# Altium schematic sheet ___Main.SchDoc
size A3; Address1: 00-<Schema Name>; ModifiedBy: -; RevisionDate: -; Size: A3
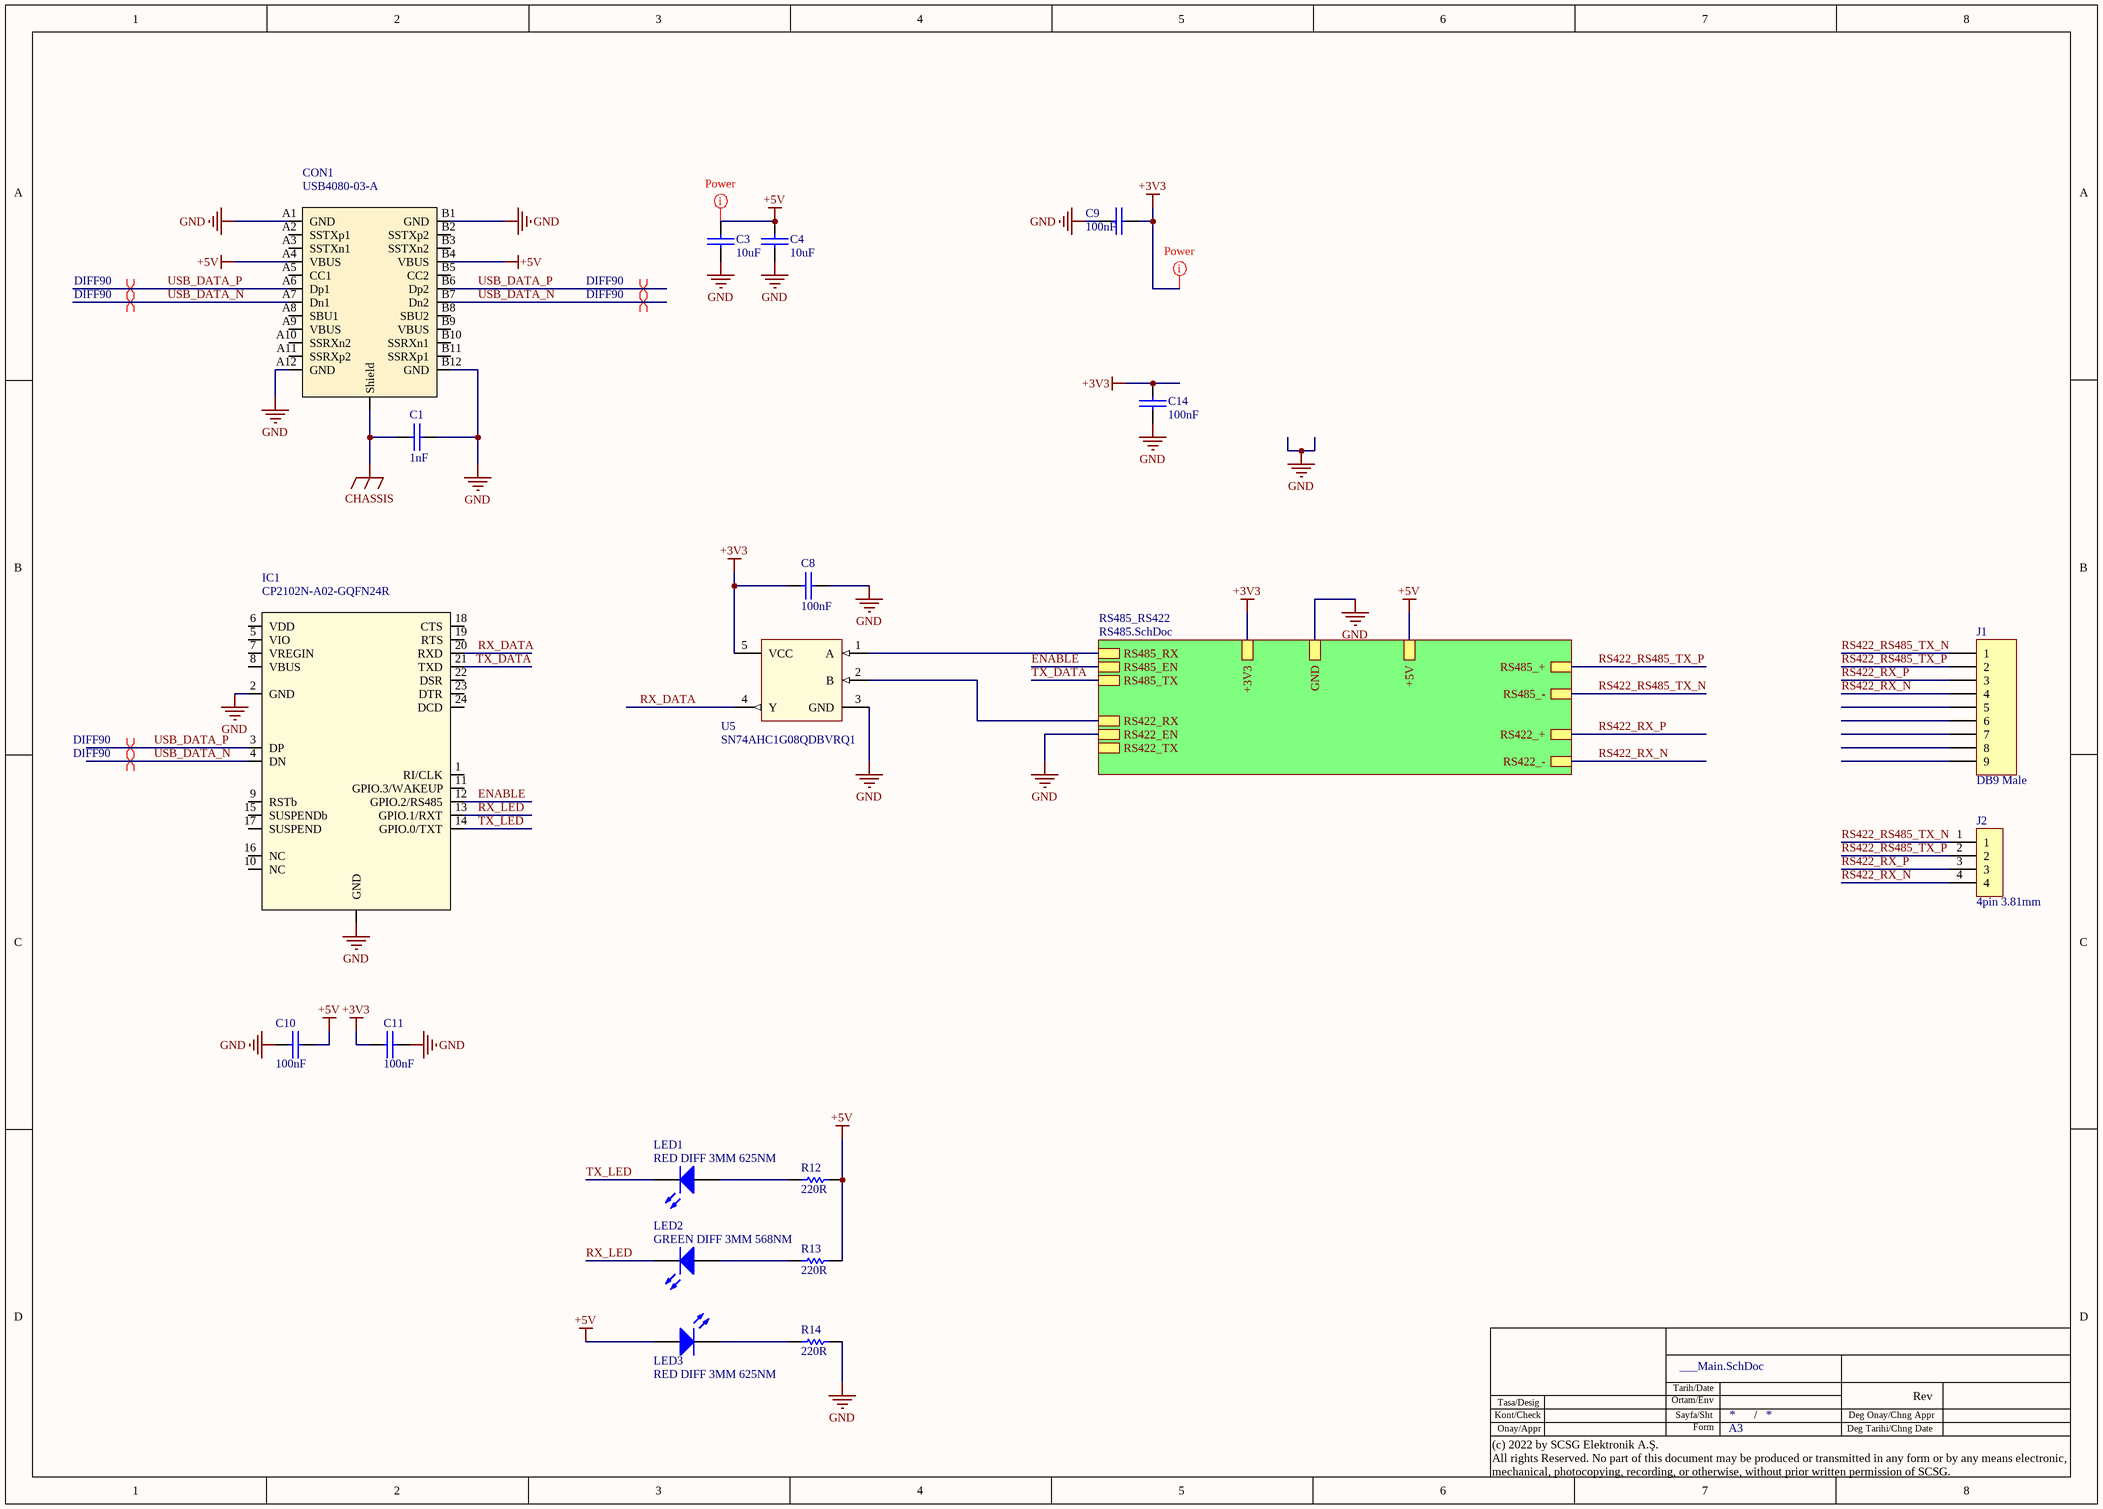
[diagram p0: ___Main.SchDoc]

## Parts
C1  value 1nF  [C1206-N - H 1.75×L 3.4×W 1.8]  (hidden comment: CAPL10012820E)
C3  value 10uF  [C0603-N]  (hidden comment: CAP110050340F)
C4  value 10uF  [C0603-N]  (hidden comment: CAP110050340F)
C8  value 100nF  [C0402-N]  (hidden comment: CAP110030425E)
C9  value 100nF  [C0402-N]  (hidden comment: CAP110030425E)
C10  value 100nF  [C0402-N]  (hidden comment: CAP110030425E)
C11  value 100nF  [C0402-N]  (hidden comment: CAP110030425E)
C14  value 100nF  [C0402-N]  (hidden comment: CAP110030425E)
CON1  USB4080-03-A  [GCT_USB4080-03-A_REVA1]
IC1  CP2102N-A02-GQFN24R  [QFN24]
J1  value DB9 Male  [CON110090001]  (hidden comment: CON110090001)
J2  value 4pin 3.81mm  [PV04-3,81]  (hidden comment: CON1500412AE)
LED1  value RED DIFF 3MM 625NM  [RADIAL 3.2X5.4]  (hidden comment: LED0002WP710)
LED2  value GREEN DIFF 3MM 568NM  [RADIAL 3.2X5.4]  (hidden comment: LED0202WP710)
LED3  value RED DIFF 3MM 625NM  [RADIAL 3.2X5.4]  (hidden comment: LED0002WP710)
R12  value 220R  [0402-N]  (hidden comment: RESE24002201)
R13  value 220R  [0402-N]  (hidden comment: RESE24002201)
R14  value 220R  [0402-N]  (hidden comment: RESE24002201)
U5  value SN74AHC1G08QDBVRQ1  [SOT23-5]  (hidden comment: IC74AHC1G081)

## Sub-sheets
RS485_RS422 = RS485.SchDoc: RS485_RX, RS485_EN, RS485_TX, RS422_RX, RS422_EN, RS422_TX, RS485_+, RS485_-, RS422_-, RS422_+, +3V3, GND, +5V

## Nets
+3V3: C8.2 C9.1 C11.1 C14.2 U5.5(VCC) ; sheet RS485_RS422/+3V3
+5V: C3.2 C4.2 C10.1 CON1.A4(VBUS) CON1.B4(VBUS) LED3.1(A) R12.2 R13.2 ; sheet RS485_RS422/+5V
CHASSIS: C1.2 CON1.G(Shield)
GND: C1.1 C3.1 C4.1 C8.1 C9.2 C10.2 C11.2 C14.1 CON1.A1(GND) CON1.A12(GND) CON1.B1(GND) CON1.B12(GND) IC1.2(GND) IC1.25(GND) R14.2 U5.3(GND) ; sheet RS485_RS422/RS422_EN, sheet RS485_RS422/GND
ENABLE: IC1.12(GPIO.2/RS485) ; sheet RS485_RS422/RS485_EN
RS422_RS485_TX_N: J1.1 J2.1 ; sheet RS485_RS422/RS485_-
RS422_RS485_TX_P: J1.2 J2.2 ; sheet RS485_RS422/RS485_+
RS422_RX_N: J1.4 J2.4 ; sheet RS485_RS422/RS422_-
RS422_RX_P: J1.3 J2.3 ; sheet RS485_RS422/RS422_+
RX_DATA: IC1.20(RXD) U5.4(Y)
RX_LED: IC1.13(GPIO.1/RXT) LED2.2(K)
TX_DATA: IC1.21(TXD) ; sheet RS485_RS422/RS485_TX
TX_LED: IC1.14(GPIO.0/TXT) LED1.2(K)
USB_DATA_N: CON1.A7(Dn1) CON1.B7(Dn2) IC1.4(DN)
USB_DATA_P: CON1.A6(Dp1) CON1.B6(Dp2) IC1.3(DP)
NetLED1_1: LED1.1(A) R12.1
NetLED2_1: LED2.1(A) R13.1
NetLED3_2: LED3.2(K) R14.1
NetU5_1: U5.1(A) ; sheet RS485_RS422/RS485_RX
NetU5_2: U5.2(B) ; sheet RS485_RS422/RS422_RX

Not connected (* = marked no-connect by the designer): CON1 A2(SSTXp1) A3(SSTXn1) A5(CC1) A8(SBU1) A9(VBUS) A10(SSRXn2) A11(SSRXp2) B2(SSTXp2) B3(SSTXn2) B5(CC2) B8(SBU2) B9(VBUS) B10(SSRXn1) B11(SSRXp1); IC1 1(RI/CLK) 5(VIO) 6(VDD) 7(VREGIN) 8(VBUS) 9(RSTb) 10(NC) 11(GPIO.3/WAKEUP) 15(SUSPENDb) 16(NC) 17(SUSPEND) 18(CTS) 19(RTS) 22(DSR) 23(DTR) 24(DCD); J1 5 6 7 8 9

## Layout directives
net class PowerGeneral: +3V3, +5V
differential pair; net class DIFF90: USB_DATA_N, USB_DATA_P

## Notes on the sheet
- Tarih/Date
- Kont/Check
- Tasa/Desig
- Onay/Appr
- Ortam/Env
- Sayfa/Sht
- Form
- A3
- /
- Deg Tarihi/Chng Date
- Deg Onay/Chng Appr
- Rev
- (c) 2022 by SCSG Elektronik A.Ş.
  All rights Reserved. No part of this document may be produced or transmitted in any form or by any means electronic, mechanical, photocopying, recording, or otherwise, without prior written permission of SCSG.

## Library data of the parts
C1 = CAPL10012820E: 1nF, 1206, X7R, 2kV, % 10, AEC-Q200; Manufacturer: Kemet; Requested By: Mehmet Ali İpin; Order Number: C1206C102KGRACAUTO; DS: 14477; Tolerance: +10% -10%; Value1: C3100; Talep ID: 3983; Capacitance: 1000pF; Voltage - Rated: 2000V (2kV); Tanımlanma Tarihi: 03.03.2016; Revizyon Tarihi: 03.03.2016; Price: 0,0517; Operating Temperature: -55C +125C; Height: 1.75mm; helpURL: \\pavofilesrv\DataSheets\DS14400\DS14477.PDF; Package / Case: C1206-N - H 1.75×L 3.4×W 1.8, C1206-S - H 1.75×L 3.4×W 1.8; Digikey Code: 399-12976-2-ND; Mounting Type: Surface Mount, MLCC; Moisture Sensitivity Level (MSL): 1; Supplier 1: Digi-Key; Supplier Part Number 1: 399-12976-2-ND; RoHS: RoHS Compliant; Category: Capacitors; Packaging: Tape & Reel (TR); Temperature Coefficient: X7R; Applications: Automotive; Ratings: AEC-Q200; Size / Dimension: 0.126" L x 0.063" W (3.20mm x 1.60mm); Features: High Voltage; ComponentLink1URL: http://www.kemet.com/docfinder?Partnumber=C1206C102KGRACAUTO; ComponentLink1Description: http://www.kemet.com/docfinder?Partnumber=C1206C102KGRACAUTO
C3 C4 = CAP110050340F: 10uF, 0603,  X5R, 10V, % 20; Manufacturer: Samsung; Requested By: Mehmet Ali İPİN; Order Number: CL10A106MP8NNNC; DS: 13591; Capacitance (pF): 10000000; Tolerance: 20; Value1: C7100; Talep ID: 2378; Tanımlanma Tarihi: 23.10.2013; Revizyon Tarihi: 23.10.2013; Price: 0,0765; Operating Temperature: -55°C ~ 85°C; Height: 0.9mm; helpURL: \\pavofilesrv\DataSheets\DS13500\DS13591.pdf; Voltage - Rated: 10V; Package / Case: 0603; Digikey Code: 1276-1871-2-ND; Mounting Type: Surface Mount; Moisture Sensitivity Level (MSL): 1
C8-C11 C14 = CAP110030425E: 100nF, 0402, X7R, 16V, % 10; Manufacturer: Samsung; Manufacturer1: TDK Corporation; Order Number: CL05B104KO5NNNC; DS: 13510; Tolerance: % 10; Order Number1: C1005X7R1C104K; Order Number2: C0402C104K4RACTU; Value1: C5100; Price: 0,00100; Height: 0.55mm; Digikey Code: 1276-1001-2-ND; helpURL: \\pavofilesrv\DataSheets\DS13500\DS13510.pdf; Manufacturer2: Kemet; Mounting Type: Surface Mount; Moisture Sensitivity Level (MSL): 1; Digikey Code2: 399-3521-2-ND
CON1 = USB4080-03-A: USB Type C Rec, 3 Horizontal, SMT, Top mnt, 7.9mm body; Manufacturer: Global Connector Technology; Gender: Receptacle; Purpose Of Usage: BASIC; Supplier 1: Future Electronics; Manufacturer Part Number: USB4080-03-A; RoHS: Yes; Category: CONNECTORS; Supplier Part Number 1: 5146382; Orientation: Right Angle; Sub-Category: USB Type-C; Mount: SMD; Local Supplier: FUTURE; Price 10K: 0.463; Stock ID: ??
IC1 = CP2102N-A02-GQFN24R: IC Usb to Uart Bridge QFN24 / Usb Bridge, Usb to Uart Usb 2.0 Uart Interface 24-QFN (4X4); Manufacturer: Silicon Lab; Max Supply Voltage: 3.6V; Min Supply Voltage: 3V; Purpose Of Usage: BASIC; Manufacturer Part Number: CP2102N-A02-GQFN24R; RoHS: YES; Category: INTEGRATED CIRCUITS; Ambient Temperature Range High: 85°C; Max Operating Temperature: 85°C; Min Operating Temperature: -40°C; Case/Package: QFN; Lead Free: Lead Free; Mount: SMD; MSL: 1; Stock ID: ??; Sub-Category: USB to UART; Supplier 1: Digi-Key; Supplier Part Number 1: 336-5888-2-ND
J1 = CON110090001: DB9,Male,Edge Connect; DS: 000000; Price: *; Revizyon Tarihi: 06/01/06; Order Number: *
J2 = CON1500412AE: 4 PIN 8A 160V 2.5 kVrms/60s; Manufacturer: Euroclamp; Requested By: Kutsal ANIL; Order Number: PV04-3,81-H; DS: 12619; Gender: Male; Pitch (mm): 3.81mm; Revizyon Tarihi: 05.10.2011; Tanımlanma Tarihi: 05.10.2011; Price: *; Operating Temperature: -40°C ÷ +130°C; Height: 7.25mm; Footprint: *; Mounting Angle: *; Mounting Type: Through Hole; helpURL: \\pavofilesrv\DataSheets\DS12600\DS12619A.pdf; Digikey Code: ***; Package / Case: ***; Moisture Sensitivity Level (MSL): 1
LED1 LED3 = LED0002WP710: RED DIFF 3MM 625NM; Manufacturer: Kingbright; Requested By: Mustafa GÜLERYÜZ; Order Number: WP710A10ID; DS: 13722; Voltage (V): 2; Talep ID: 2583; Revizyon Tarihi: 18.12.2013; Tanımlanma Tarihi: 18.12.2013; Price: 0,0481; Height: 5.4mm; Max Forward voltage drop: *; helpURL: \\pavofilesrv\DataSheets\DS13700\DS13722.pdf; Operating Temperature: ***; Package / Case: Radial; Digikey Code: 754-1606-ND; Mounting Type: Through Hole; Moisture Sensitivity Level (MSL): 1
LED2 = LED0202WP710: GREEN DIFF 3MM 568NM; Manufacturer: Kingbright; Requested By: Mustafa GÜLERYÜZ; Order Number: WP710A10GD; DS: 13723; Voltage (V): 2,2; Talep ID: 2584; Revizyon Tarihi: 18.12.2013; Tanımlanma Tarihi: 18.12.2013; Price: 0,0481; Height: 5.4mm; helpURL: \\pavofilesrv\DataSheets\DS13700\DS13723.pdf; Operating Temperature: ***; Package / Case: Radial; Digikey Code: 754-1603-ND; Mounting Type: Through Hole; Moisture Sensitivity Level (MSL): 1
R12-R14 = RESE24002201: E24, 220R, 0402, %1; Manufacturer: Panasonic - ECG; Order Number: ERJ-2RKF2200X; Value1: R5220; Tolerance: ***; DS: *; Price: *; Revizyon Tarihi: 20.01.2011; Tanımlanma Tarihi: 20.01.2011; Digikey Code: P220LTR-ND; Operating Temperature: ***; Mounting Type: Surface Mount; Requested By: ***; Height: 0.4mm; Moisture Sensitivity Level (MSL): 1
U5 = IC74AHC1G081: IC SNGL 2IN POS-AND GATE AUTOMOTIVE QUALIFIED; Manufacturer: Texas Instruments; Requested By: Alper GOYNUSEN; DS: 13309; Talep ID: 1498; Tanımlanma Tarihi: 14.05.2013; Revizyon Tarihi: 13.11.2013; Order Number: SN74AHC1G08QDBVRQ1; Price: 0,1044; Height: 1.45mm; helpURL: \\pavofilesrv\DataSheets\DS13300\DS13309.pdf; Operating Temperature: -40C +125C; Package / Case: SOT-23-5; Tolerance: *; Digikey Code: 296-23875-2-ND; Mounting Type: Surface Mount; Moisture Sensitivity Level (MSL): 1